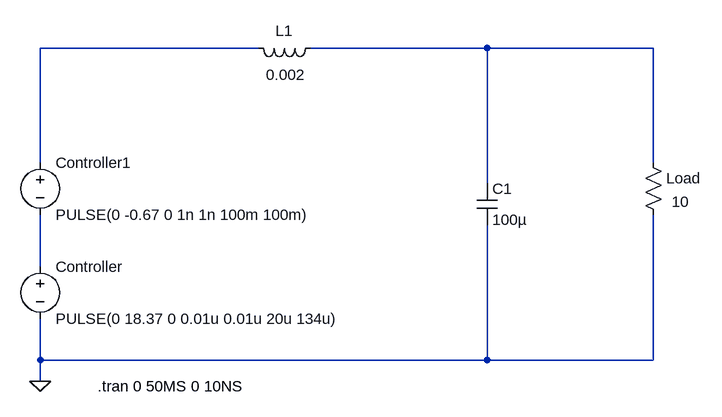
[diagram p0: schematic StepDownConverterVersion1.asc]
StepDownConverterVersion1.asc, the LTspice schematic file:
Version 4
SHEET 1 5120 680
WIRE 2960 -288 2624 -288
WIRE 3312 -288 3040 -288
WIRE 3568 -288 3312 -288
WIRE 2624 -112 2624 -288
WIRE 3568 -112 3568 -288
WIRE 3312 -80 3312 -288
WIRE 2624 48 2624 -32
WIRE 2624 192 2624 128
WIRE 3312 192 3312 -16
WIRE 3312 192 2624 192
WIRE 3568 192 3568 -32
WIRE 3568 192 3312 192
WIRE 2624 224 2624 192
FLAG 2624 224 0
SYMBOL ind 3056 -304 R90
WINDOW 0 5 56 VBottom 2
WINDOW 3 41 54 VTop 2
SYMATTR InstName L1
SYMATTR Value 0.002
SYMATTR SpiceLine Rser=0.4
SYMBOL res 3552 -128 R0
WINDOW 3 44 76 Left 2
SYMATTR Value 10
SYMATTR InstName Load
SYMBOL voltage 2624 32 R0
WINDOW 123 0 0 Left 0
WINDOW 39 0 0 Left 0
SYMATTR InstName Controller
SYMATTR Value PULSE(0 18.37 0 0.01u 0.01u 20u 134u)
SYMBOL cap 3296 -80 R0
SYMATTR InstName C1
SYMATTR Value 100µ
SYMBOL voltage 2624 -128 R0
WINDOW 123 0 0 Left 0
WINDOW 39 0 0 Left 0
SYMATTR InstName Controller1
SYMATTR Value PULSE(0 -0.67 0 1n 1n 100m 100m)
TEXT 2712 232 Left 2 !.tran 0 50MS 0 10NS

The netlist it stands for:
* StepDownConverterVersion1.asc
L1 N002 N001 0.002 Rser=0.4
R§Load N002 0 10
V§Controller N003 0 PULSE(0 18.37 0 0.01u 0.01u 20u 134u)
C1 N002 0 100µ
V§Controller1 N001 N003 PULSE(0 -0.67 0 1n 1n 100m 100m)
.tran 0 50MS 0 10NS
.backanno
.end